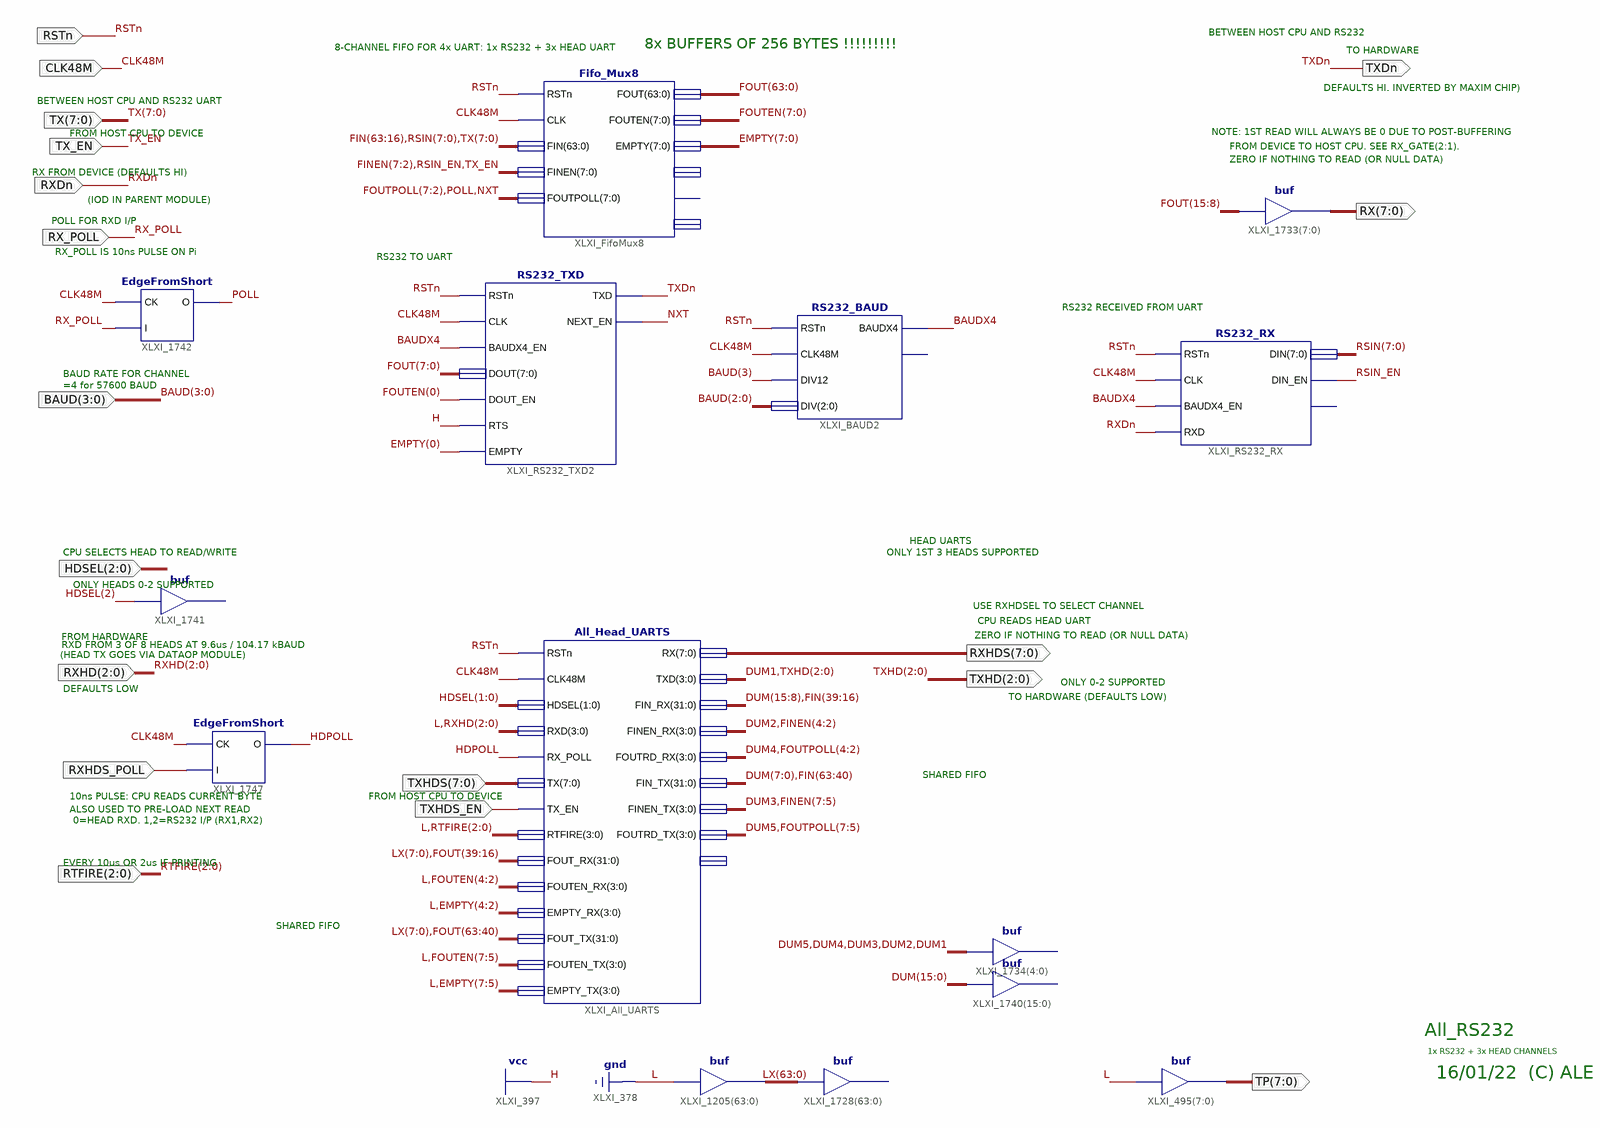
[diagram p0: schematic sheet 1]
// Xilinx ISE schematic All_RS232.sch (spartan3e) as structural Verilog: 14 symbols, 18 ports
module All_RS232 (
  input  CLK48M,
  input  RSTn,
  input  RXDn,
  input  [7:0] TX,
  input  TX_EN,
  input  RX_POLL,
  input  TXHDS_EN,
  input  [7:0] TXHDS,
  input  [3:0] BAUD,
  input  [2:0] HDSEL,
  input  [2:0] RXHD,
  input  RXHDS_POLL,
  input  [2:0] RTFIRE,
  output TXDn,
  output [7:0] TP,
  output [7:0] RX,
  output [7:0] RXHDS,
  output [2:0] TXHD
);

  wire BAUDX4, DUM1, DUM2, DUM3, DUM4, DUM5, HDPOLL, NXT, POLL, RSIN_EN;
  wire [7:0] EMPTY, FOUTEN, RSIN;
  wire [7:2] FINEN, FOUTPOLL;
  wire [15:0] DUM;
  wire [63:0] FOUT, LX;
  wire [63:16] FIN;

  assign TP = {8{1'b0}};  // buf XLXI_495[7..0], 8 bits wide
  assign LX = {64{1'b0}};  // buf XLXI_1205[63..0], 64 bits wide
  Fifo_Mux8 XLXI_FifoMux8 (
    .CLK(CLK48M), .EMPTY(EMPTY), .FIN({FIN, RSIN, TX}), .FINEN({FINEN, RSIN_EN, TX_EN}), .FOUT(FOUT),
    .FOUTEN(FOUTEN), .FOUTPOLL({FOUTPOLL, POLL, NXT}), .RSTn(RSTn));  // open: ANYERR, FULL, TP
  // buf XLXI_1728[63..0] has open pins: I=LX, O=open
  RS232_TXD XLXI_RS232_TXD2 (
    .BAUDX4_EN(BAUDX4), .CLK(CLK48M), .DOUT(FOUT[7:0]), .DOUT_EN(FOUTEN[0]), .EMPTY(EMPTY[0]), .NEXT_EN(NXT),
    .RSTn(RSTn), .RTS(1'b1), .TXD(TXDn));
  RS232_RX XLXI_RS232_RX (
    .BAUDX4_EN(BAUDX4), .CLK(CLK48M), .DIN(RSIN), .DIN_EN(RSIN_EN), .RSTn(RSTn), .RXD(RXDn));  // open: INHIBIT
  RS232_BAUD XLXI_BAUD2 (
    .BAUDX4(BAUDX4), .CLK48M(CLK48M), .DIV(BAUD[2:0]), .DIV12(BAUD[3]), .RSTn(RSTn));  // open: BAUDX2
  assign RX = FOUT[15:8];  // buf XLXI_1733[7..0], 8 bits wide
  // buf XLXI_1734[4..0] has open pins: I={DUM5, DUM4, DUM3, DUM2, DUM1}, O=open
  // buf XLXI_1740[15..0] has open pins: I=DUM, O=open
  EdgeFromShort XLXI_1742 (.CK(CLK48M), .I(RX_POLL), .O(POLL));
  All_Head_UARTS XLXI_All_UARTS (
    .RSTn(RSTn), .CLK48M(CLK48M), .HDSEL(HDSEL[1:0]), .RXD({1'b0, RXHD}), .RX_POLL(HDPOLL), .TX(TXHDS),
    .TX_EN(TXHDS_EN), .RTFIRE({1'b0, RTFIRE}), .FOUT_RX({LX[7:0], FOUT[39:16]}),
    .FOUTEN_RX({1'b0, FOUTEN[4:2]}), .EMPTY_RX({1'b0, EMPTY[4:2]}), .FOUT_TX({LX[7:0], FOUT[63:40]}),
    .FOUTEN_TX({1'b0, FOUTEN[7:5]}), .EMPTY_TX({1'b0, EMPTY[7:5]}), .RX(RXHDS), .TXD({DUM1, TXHD}),
    .FIN_RX({DUM[15:8], FIN[39:16]}), .FINEN_RX({DUM2, FINEN[4:2]}), .FOUTRD_RX({DUM4, FOUTPOLL[4:2]}),
    .FIN_TX({DUM[7:0], FIN[63:40]}), .FINEN_TX({DUM3, FINEN[7:5]}), .FOUTRD_TX({DUM5, FOUTPOLL[7:5]}));  // open: TP
  // buf XLXI_1741 has open pins: I=HDSEL[2], O=open
  EdgeFromShort XLXI_1747 (.CK(CLK48M), .I(RXHDS_POLL), .O(HDPOLL));

  // Notes on the sheet:
  //   BETWEEN HOST CPU AND RS232
  //   8x BUFFERS OF 256 BYTES !!!!!!!!!
  //   8-CHANNEL FIFO FOR 4x UART: 1x RS232 + 3x HEAD UART
  //   TO HARDWARE
  //   DEFAULTS HI. INVERTED BY MAXIM CHIP)
  //   BETWEEN HOST CPU AND RS232 UART
  //   NOTE: 1ST READ WILL ALWAYS BE 0 DUE TO POST-BUFFERING
  //   FROM HOST CPU TO DEVICE
  //   FROM DEVICE TO HOST CPU. SEE RX_GATE(2:1).
  //   ZERO IF NOTHING TO READ (OR NULL DATA)
  //   RX FROM DEVICE (DEFAULTS HI)
  //   (IOD IN PARENT MODULE)
  //   POLL FOR RXD I/P
  //   RX_POLL IS 10ns PULSE ON Pi
  //   RS232 TO UART
  //   RS232 RECEIVED FROM UART
  //   BAUD RATE FOR CHANNEL
  //   =4 for 57600 BAUD
  //   HEAD UARTS
  //   CPU SELECTS HEAD TO READ/WRITE
  //   ONLY 1ST 3 HEADS SUPPORTED
  //   ONLY HEADS 0-2 SUPPORTED
  //   USE RXHDSEL TO SELECT CHANNEL
  //   CPU READS HEAD UART
  //   ZERO IF NOTHING TO READ (OR NULL DATA)
  //   FROM HARDWARE
  //   RXD FROM 3 OF 8 HEADS AT 9.6us / 104.17 kBAUD
  //   (HEAD TX GOES VIA DATAOP MODULE)
  //   ONLY 0-2 SUPPORTED
  //   DEFAULTS LOW
  //   TO HARDWARE (DEFAULTS LOW)
  //   SHARED FIFO
  //   10ns PULSE: CPU READS CURRENT BYTE
  //   FROM HOST CPU TO DEVICE
  //   ALSO USED TO PRE-LOAD NEXT READ
  //   0=HEAD RXD. 1,2=RS232 I/P (RX1,RX2)
  //   EVERY 10us OR 2us IF PRINTING
  //   SHARED FIFO
  //   All_RS232
  //   1x RS232 + 3x HEAD CHANNELS
  //   16/01/22  (C) ALE
endmodule
